# EAGLE design power_routing_board (EAGLE 9.6.2)
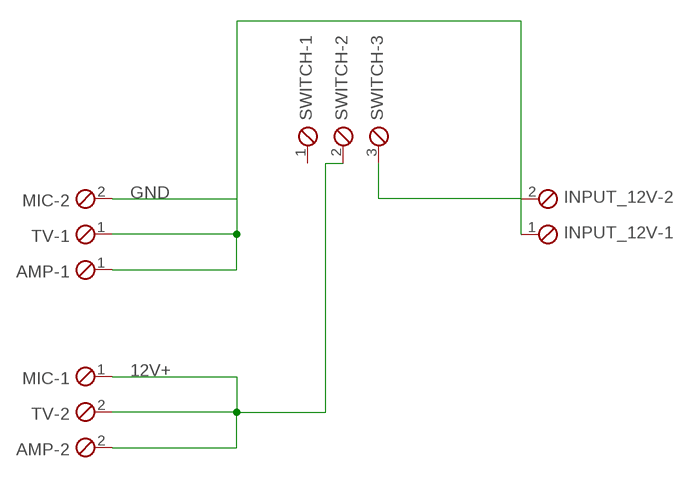
[diagram p0: schematic, sheet 1]

## Parts
AMP  TB3POL  MKDS1/2-3,81  [2POL381]
INPUT_12V  TB3POL  MKDS1/2-3,81  [2POL381]
MIC  TB3POL  MKDS1/2-3,81  [2POL381]
SWITCH  TB3POL  MKDS1/3-3,81  [3POL381]
TV  TB3POL  MKDS1/2-3,81  [2POL381]

## Nets
12V+: AMP.2 MIC.1 SWITCH.2 TV.2
GND: AMP.1 INPUT_12V.1 MIC.2 TV.1
N$1: INPUT_12V.2 SWITCH.3
Unconnected: SWITCH.1

## Library data of the parts
AMP INPUT_12V MIC TV = con-phoenix-381:MKDS1/2-3,81: MKDS 1/2-3,81 - Order No. 1727010 (RS-Online - 101-5384) Pitch: 3,81mm Number of terminals: 2 Rated Voltage: 160V Maximum load current/ cross section: 12A/1.5mm2-AWG16 Housing Interlocking: none Color: Green
SWITCH = con-phoenix-381:MKDS1/3-3,81: MKDS 1/3-3,81 - Order No. 1727023 (RS-Online - 101-5390) Pitch: 3,81mm Number of terminals: 3 Rated Voltage: 160V Maximum load current/ cross section: 12A/1.5mm2-AWG16 Housing Interlocking: none Color: Green

## Board
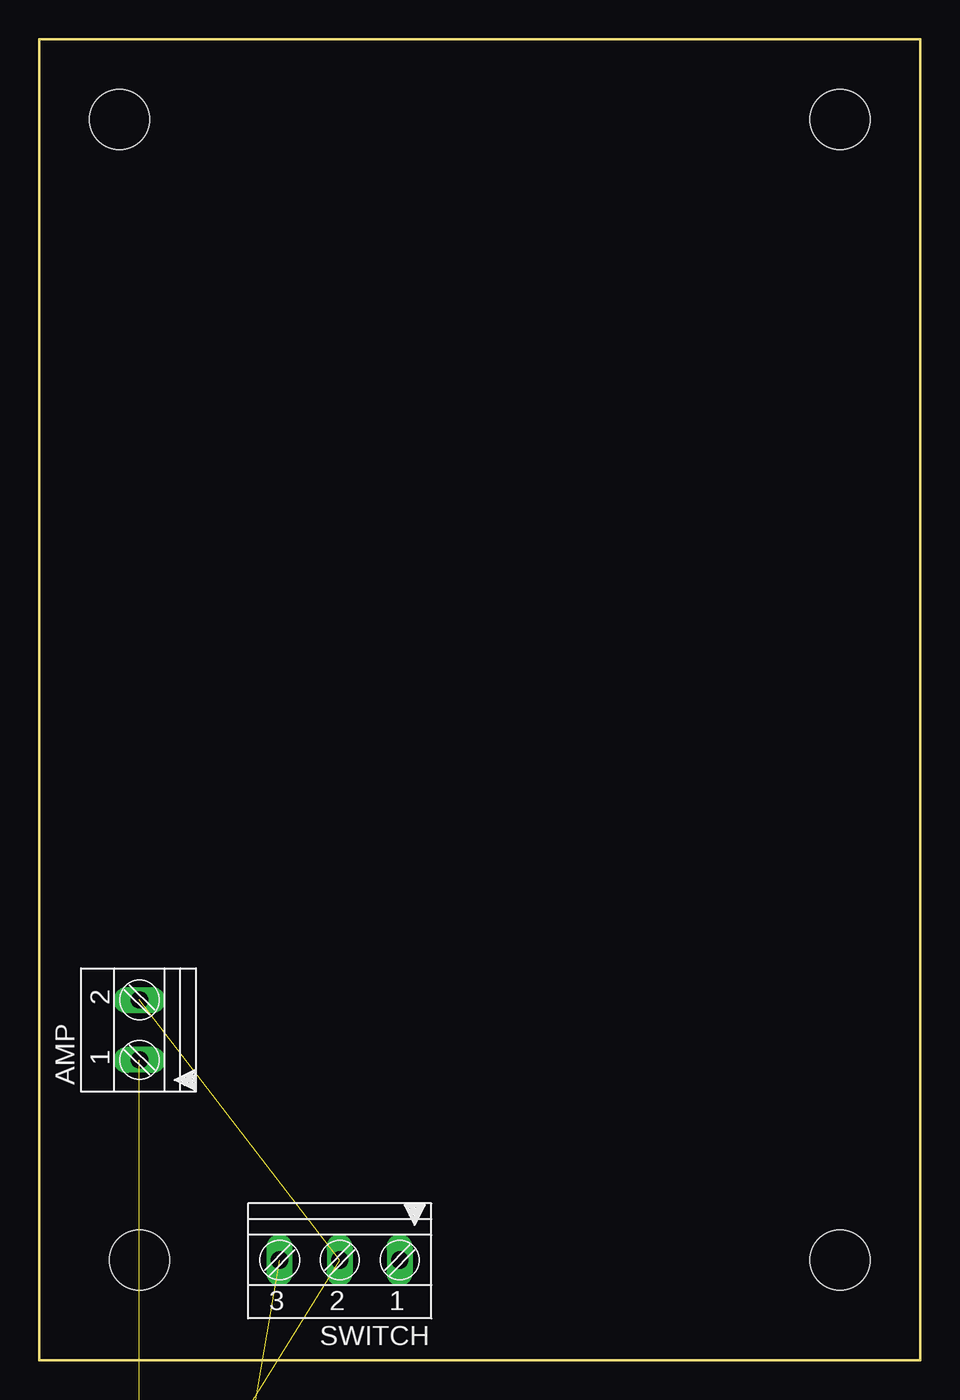
[diagram p1: board, top side]
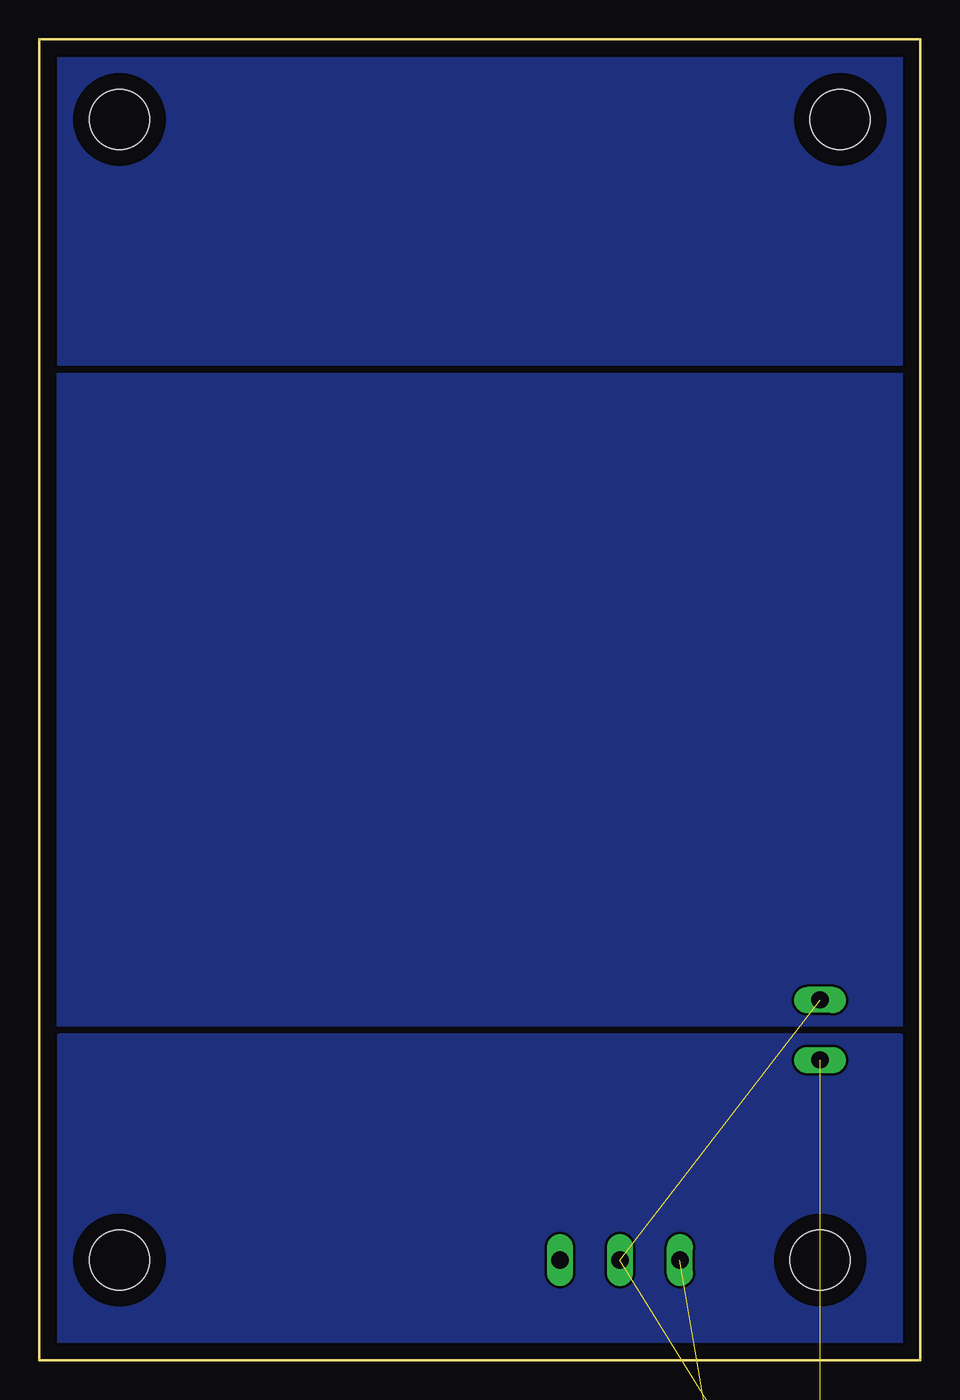
[diagram p2: board, bottom side, seen from below]

Size 55.88 x 83.82 mm. Coordinates in mm from the lower left corner, seen from the top.
Outline: 0,0 55.88,0 55.88,83.82 0,83.82 0,0
Copper layers (1*16): Top 0.035mm / dielectric 1.5mm / Bottom 0.035mm
Design rules "default": minimum track width 6mil, minimum drill 0.35mm, track to track 6mil, track to pad 6mil, pad to pad 6mil, via to via 6mil, smd to smd 6mil, copper to edge 40mil, drill to drill 6mil, minimum pad ring 10mil, minimum via ring 8mil, stop-mask expansion 4mil, vias tented up to drill 0mil, thermal gap 10mil
Holes 3.81 mm at 5.08,78.74 50.8,78.74 6.35,6.35 50.8,6.35

### Footprints (pad centres in the part's own frame; a part is rotated, then mirrored left to right if it is on the bottom)
2POL381 = drill 1.1 long: 1 0,0; 2 3.81,0
3POL381 = drill 1.1 long: 1 0,0; 2 3.81,0; 3 7.62,0

### Placement (x,y rotation side)
AMP  6.35,19.05 90 top
INPUT_12V  2.54,-45.72 0 top  (outside the outline)
MIC  2.54,-20.32 0 top  (outside the outline)
SWITCH  22.86,6.35 180 top
TV  2.54,-33.02 0 top  (outside the outline)

### Tracks (layer width: path | path; a pad name or v marks a point on that pad's centre or on a via)
12V+  (3 unrouted)
GND  (3 unrouted)
  pour Bottom: 0,62.23 55.88,62.23 55.88,21.59 0,21.59
MIC_GND
  pour Bottom: 1.27,0 1.27,20.32 54.61,20.32 54.61,0
N$1  (1 unrouted)
TV_GND
  pour Bottom: 1.27,82.55 1.27,63.5 54.61,63.5 54.61,82.55